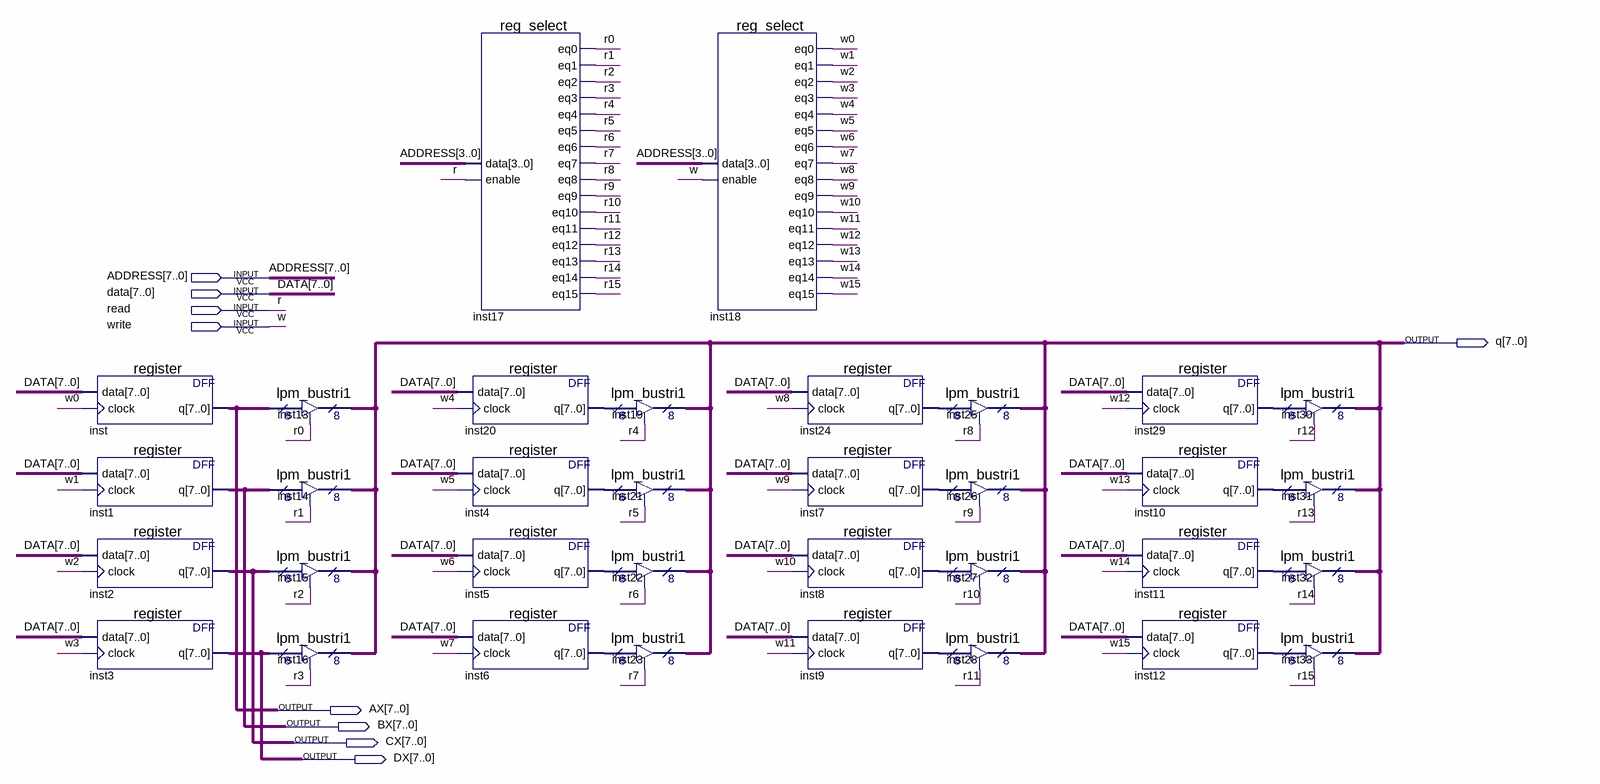
[diagram p0: schematic sheet]
// Quartus schematic registers.bdf as structural Verilog: 34 symbols, 9 pins
module registers (
  input  [7:0] ADDRESS,
  input  [7:0] data,
  input  read,
  input  write,
  output [7:0] q,
  output [7:0] AX,
  output [7:0] BX,
  output [7:0] CX,
  output [7:0] DX
);

  wire r0, r1, r2, r3, r4, r5, r6, r7, r8, r9, r10, r11, r12, r13, r14, r15, w0, w1, w2, w3, w4, w5, w6, w7,
       w8, w9, w10, w11, w12, w13, w14, w15;
  wire [7:0] inst4_q, inst5_q, inst6_q, inst7_q, inst8_q, inst9_q, inst10_q, inst11_q, inst12_q, inst20_q,
       inst24_q, inst29_q;

  register inst (.data(data), .clock(w0), .q(AX));
  register inst1 (.data(data), .clock(w1), .q(BX));
  register inst2 (.data(data), .clock(w2), .q(CX));
  register inst3 (.data(data), .clock(w3), .q(DX));
  lpm_bustri1 inst13 (.enabledt(r0), .data(AX), .tridata(q));
  lpm_bustri1 inst14 (.enabledt(r1), .data(BX), .tridata(q));
  lpm_bustri1 inst15 (.enabledt(r2), .data(CX), .tridata(q));
  lpm_bustri1 inst16 (.enabledt(r3), .data(DX), .tridata(q));
  reg_select inst17 (
    .data(ADDRESS[3:0]), .enable(read), .eq0(r0), .eq1(r1), .eq2(r2), .eq3(r3), .eq4(r4), .eq5(r5), .eq6(r6),
    .eq7(r7), .eq8(r8), .eq9(r9), .eq10(r10), .eq11(r11), .eq12(r12), .eq13(r13), .eq14(r14), .eq15(r15));
  register inst20 (.data(data), .clock(w4), .q(inst20_q));
  register inst4 (.data(data), .clock(w5), .q(inst4_q));
  register inst5 (.data(data), .clock(w6), .q(inst5_q));
  register inst6 (.data(data), .clock(w7), .q(inst6_q));
  lpm_bustri1 inst19 (.enabledt(r4), .data(inst20_q), .tridata(q));
  lpm_bustri1 inst21 (.enabledt(r5), .data(inst4_q), .tridata(q));
  lpm_bustri1 inst22 (.enabledt(r6), .data(inst5_q), .tridata(q));
  lpm_bustri1 inst23 (.enabledt(r7), .data(inst6_q), .tridata(q));
  reg_select inst18 (
    .data(ADDRESS[3:0]), .enable(write), .eq0(w0), .eq1(w1), .eq2(w2), .eq3(w3), .eq4(w4), .eq5(w5),
    .eq6(w6), .eq7(w7), .eq8(w8), .eq9(w9), .eq10(w10), .eq11(w11), .eq12(w12), .eq13(w13), .eq14(w14),
    .eq15(w15));
  register inst24 (.data(data), .clock(w8), .q(inst24_q));
  register inst7 (.data(data), .clock(w9), .q(inst7_q));
  register inst8 (.data(data), .clock(w10), .q(inst8_q));
  register inst9 (.data(data), .clock(w11), .q(inst9_q));
  lpm_bustri1 inst25 (.enabledt(r8), .data(inst24_q), .tridata(q));
  lpm_bustri1 inst26 (.enabledt(r9), .data(inst7_q), .tridata(q));
  lpm_bustri1 inst27 (.enabledt(r10), .data(inst8_q), .tridata(q));
  lpm_bustri1 inst28 (.enabledt(r11), .data(inst9_q), .tridata(q));
  register inst29 (.data(data), .clock(w12), .q(inst29_q));
  register inst10 (.data(data), .clock(w13), .q(inst10_q));
  register inst11 (.data(data), .clock(w14), .q(inst11_q));
  register inst12 (.data(data), .clock(w15), .q(inst12_q));
  lpm_bustri1 inst30 (.enabledt(r12), .data(inst29_q), .tridata(q));
  lpm_bustri1 inst31 (.enabledt(r13), .data(inst10_q), .tridata(q));
  lpm_bustri1 inst32 (.enabledt(r14), .data(inst11_q), .tridata(q));
  lpm_bustri1 inst33 (.enabledt(r15), .data(inst12_q), .tridata(q));

  // Other names for the same wires on the sheet: r = read; w = write
endmodule
